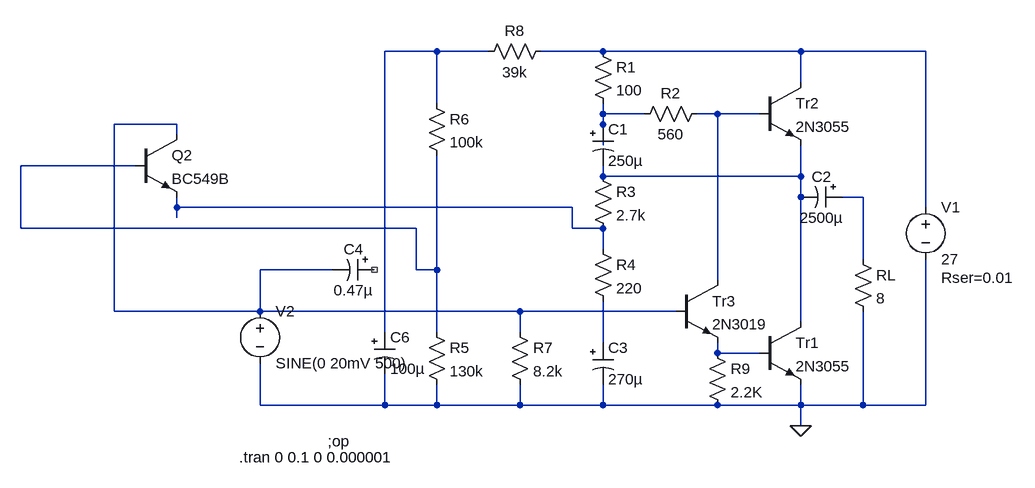
[diagram p0: schematic JC1969-modified-more.asc]
JC1969-modified-more.asc, the LTspice schematic file:
Version 4
SHEET 1 880 680
WIRE -192 -256 -272 -256
WIRE -112 -256 -192 -256
WIRE 64 -256 -32 -256
WIRE 368 -256 64 -256
WIRE 560 -256 368 -256
WIRE 368 -208 368 -256
WIRE -192 -176 -192 -256
WIRE 64 -160 64 -176
WIRE 128 -160 64 -160
WIRE 240 -160 208 -160
WIRE 304 -160 240 -160
WIRE -592 -144 -688 -144
WIRE 64 -144 64 -160
WIRE -592 -128 -592 -144
WIRE 64 -112 64 -144
WIRE -656 -80 -832 -80
WIRE 64 -64 64 -80
WIRE 368 -64 368 -112
WIRE 368 -64 64 -64
WIRE 368 -32 368 -64
WIRE 464 -32 432 -32
WIRE -592 -16 -592 -32
WIRE 16 -16 -592 -16
WIRE 560 -16 560 -256
WIRE -592 0 -592 -16
WIRE -832 16 -832 -80
WIRE -224 16 -832 16
WIRE 16 16 16 -16
WIRE 64 16 16 16
WIRE 64 48 64 16
WIRE 464 64 464 -32
WIRE -352 80 -464 80
WIRE -224 80 -224 16
WIRE -192 80 -192 -96
WIRE -192 80 -224 80
WIRE 240 96 240 -160
WIRE -688 144 -688 -144
WIRE -464 144 -464 80
WIRE -464 144 -688 144
WIRE -64 144 -464 144
WIRE 176 144 -64 144
WIRE 368 160 368 -32
WIRE -272 176 -272 -256
WIRE -192 176 -192 80
WIRE -64 176 -64 144
WIRE 64 192 64 128
WIRE 240 208 240 192
WIRE 304 208 240 208
WIRE -464 288 -464 224
WIRE -272 288 -272 240
WIRE -272 288 -464 288
WIRE -192 288 -192 256
WIRE -192 288 -272 288
WIRE -64 288 -64 256
WIRE -64 288 -192 288
WIRE 64 288 64 256
WIRE 64 288 -64 288
WIRE 240 288 64 288
WIRE 368 288 368 256
WIRE 368 288 240 288
WIRE 464 288 464 144
WIRE 464 288 368 288
WIRE 560 288 560 64
WIRE 560 288 464 288
WIRE 368 320 368 288
FLAG 368 320 0
SYMBOL npn 304 -208 R0
SYMATTR InstName Tr2
SYMATTR Value 2N3055
SYMBOL npn 304 160 R0
SYMATTR InstName Tr1
SYMATTR Value 2N3055
SYMBOL res 224 192 R0
SYMATTR InstName R9
SYMATTR Value 2.2K
SYMATTR SpiceLine tol=1 pwr=0.1
SYMBOL polcap 432 -48 R90
WINDOW 0 0 32 VBottom 2
WINDOW 3 32 32 VTop 2
SYMATTR InstName C2
SYMATTR Value 2500µ
SYMATTR Description Capacitor
SYMATTR Type cap
SYMATTR SpiceLine V=50 Irms=1.53 Rser=0.037 Lser=0 mfg="Nichicon" pn="UPR1H222MRH" type="Al electrolytic"
SYMBOL res 224 -176 R90
WINDOW 0 0 56 VBottom 2
WINDOW 3 32 56 VTop 2
SYMATTR InstName R2
SYMATTR Value 560
SYMATTR SpiceLine pwr=0.25
SYMBOL res 48 -272 R0
SYMATTR InstName R1
SYMATTR Value 100
SYMATTR SpiceLine tol=1 pwr=0.1
SYMBOL polcap 48 -144 R0
WINDOW 3 24 56 Left 2
SYMATTR Value 250µ
SYMATTR InstName C1
SYMATTR Description Capacitor
SYMATTR Type cap
SYMATTR SpiceLine V=40 Irms=0 Rser=11 Lser=0
SYMBOL res 48 -80 R0
SYMATTR InstName R3
SYMATTR Value 2.7k
SYMATTR SpiceLine pwr=0.25
SYMBOL res 48 32 R0
SYMATTR InstName R4
SYMATTR Value 220
SYMATTR SpiceLine tol=1 pwr=0.1
SYMBOL polcap 48 192 R0
WINDOW 3 24 56 Left 2
SYMATTR Value 270µ
SYMATTR InstName C3
SYMATTR Description Capacitor
SYMATTR Type cap
SYMATTR SpiceLine V=50 Irms=1.2 Rser=0.065 Lser=0 mfg="Nichicon" pn="UPL1H271MPH" type="Al electrolytic"
SYMBOL npn 176 96 R0
SYMATTR InstName Tr3
SYMATTR Value 2N3019
SYMBOL res -80 160 R0
SYMATTR InstName R7
SYMATTR Value 8.2k
SYMATTR SpiceLine pwr=0.25
SYMBOL res -208 160 R0
SYMATTR InstName R5
SYMATTR Value 130k
SYMATTR SpiceLine pwr=0.25
SYMBOL res -208 -192 R0
SYMATTR InstName R6
SYMATTR Value 100k
SYMATTR SpiceLine pwr=0.25
SYMBOL res -16 -272 R90
WINDOW 0 0 56 VBottom 2
WINDOW 3 32 56 VTop 2
SYMATTR InstName R8
SYMATTR Value 39k
SYMATTR SpiceLine pwr=0.25
SYMBOL polcap -288 64 R90
WINDOW 0 0 32 VBottom 2
WINDOW 3 32 32 VTop 2
SYMATTR InstName C4
SYMATTR Value 0.47µ
SYMATTR Description Capacitor
SYMATTR Type cap
SYMATTR SpiceLine V=50 Irms=22m Rser=3.9 Lser=0 mfg="Nichicon" pn="UPL1HR47MAH" type="Al electrolytic"
SYMBOL polcap -288 176 R0
WINDOW 3 24 56 Left 2
SYMATTR Value 100µ
SYMATTR InstName C6
SYMATTR Description Capacitor
SYMATTR Type cap
SYMATTR SpiceLine V=50 Irms=210m Rser=0.45 Lser=0 mfg="Nichicon" pn="UPR1H101MPH" type="Al electrolytic"
SYMBOL voltage 560 -32 R0
WINDOW 123 0 0 Left 2
WINDOW 39 24 124 Left 2
SYMATTR SpiceLine Rser=0.01
SYMATTR InstName V1
SYMATTR Value 27
SYMBOL voltage -464 128 R0
WINDOW 123 0 0 Left 2
WINDOW 39 0 0 Left 2
SYMATTR InstName V2
SYMATTR Value SINE(0 20mV 500)
SYMBOL res 448 48 R0
SYMATTR InstName RL
SYMATTR Value 8
SYMBOL npn -656 -128 R0
SYMATTR InstName Q2
SYMATTR Value BC549B
TEXT -360 344 Left 2 !;op
TEXT -496 368 Left 2 !.tran 0 0.1 0 0.000001

The netlist it stands for:
* JC1969-modified-more.asc
Q§Tr2 N002 N004 N007 0 2N3055
Q§Tr1 N007 N011 0 0 2N3055
R9 N011 0 2.2K tol=1 pwr=0.1
C2 N008 N007 2500µ V=50 Irms=1.53 Rser=0.037 Lser=0 mfg="Nichicon" pn="UPR1H222MRH" type="Al electrolytic"
R2 N004 N003 560 pwr=0.25
R1 N002 N003 100 tol=1 pwr=0.1
C1 N003 N007 250µ V=40 Irms=0 Rser=11 Lser=0
R3 N007 N009 2.7k pwr=0.25
R4 N009 N010 220 tol=1 pwr=0.1
C3 N010 0 270µ V=50 Irms=1.2 Rser=0.065 Lser=0 mfg="Nichicon" pn="UPL1H271MPH" type="Al electrolytic"
Q§Tr3 N004 N005 N011 0 2N3019
R7 N005 0 8.2k pwr=0.25
R5 N006 0 130k pwr=0.25
R6 N001 N006 100k pwr=0.25
R8 N002 N001 39k pwr=0.25
C4 NC_01 N005 0.47µ V=50 Irms=22m Rser=3.9 Lser=0 mfg="Nichicon" pn="UPL1HR47MAH" type="Al electrolytic"
C6 N001 0 100µ V=50 Irms=210m Rser=0.45 Lser=0 mfg="Nichicon" pn="UPR1H101MPH" type="Al electrolytic"
V1 N002 0 27 Rser=0.01
V2 N005 0 SINE(0 20mV 500)
RL N008 0 8
Q2 N005 N006 N009 0 BC549B
.model NPN NPN
.model PNP PNP
.lib standard.bjt
;op
.tran 0 0.1 0 0.000001
.backanno
.end